# Altium schematic sheet Power.SchDoc
size 420 x 297 mm; SheetNumber: 4; SheetTotal: 10; PageSetup: Record=PageOptions|CenterHorizontal=True|CenterVertical=True|PrintScale=0.96|XCorrection=1.00|YCorrection=1.00|PrintKind=1|BorderSize=5000000|LeftOffset=0|BottomOffset=0|Orientation=2|PaperLength=4318|PaperWidth=2794|Scale=100|PaperSource=7|PrintQuality=600|MediaType=1|DitherType=10|PaperKind=11" x 17"|PrintScaleMode=1
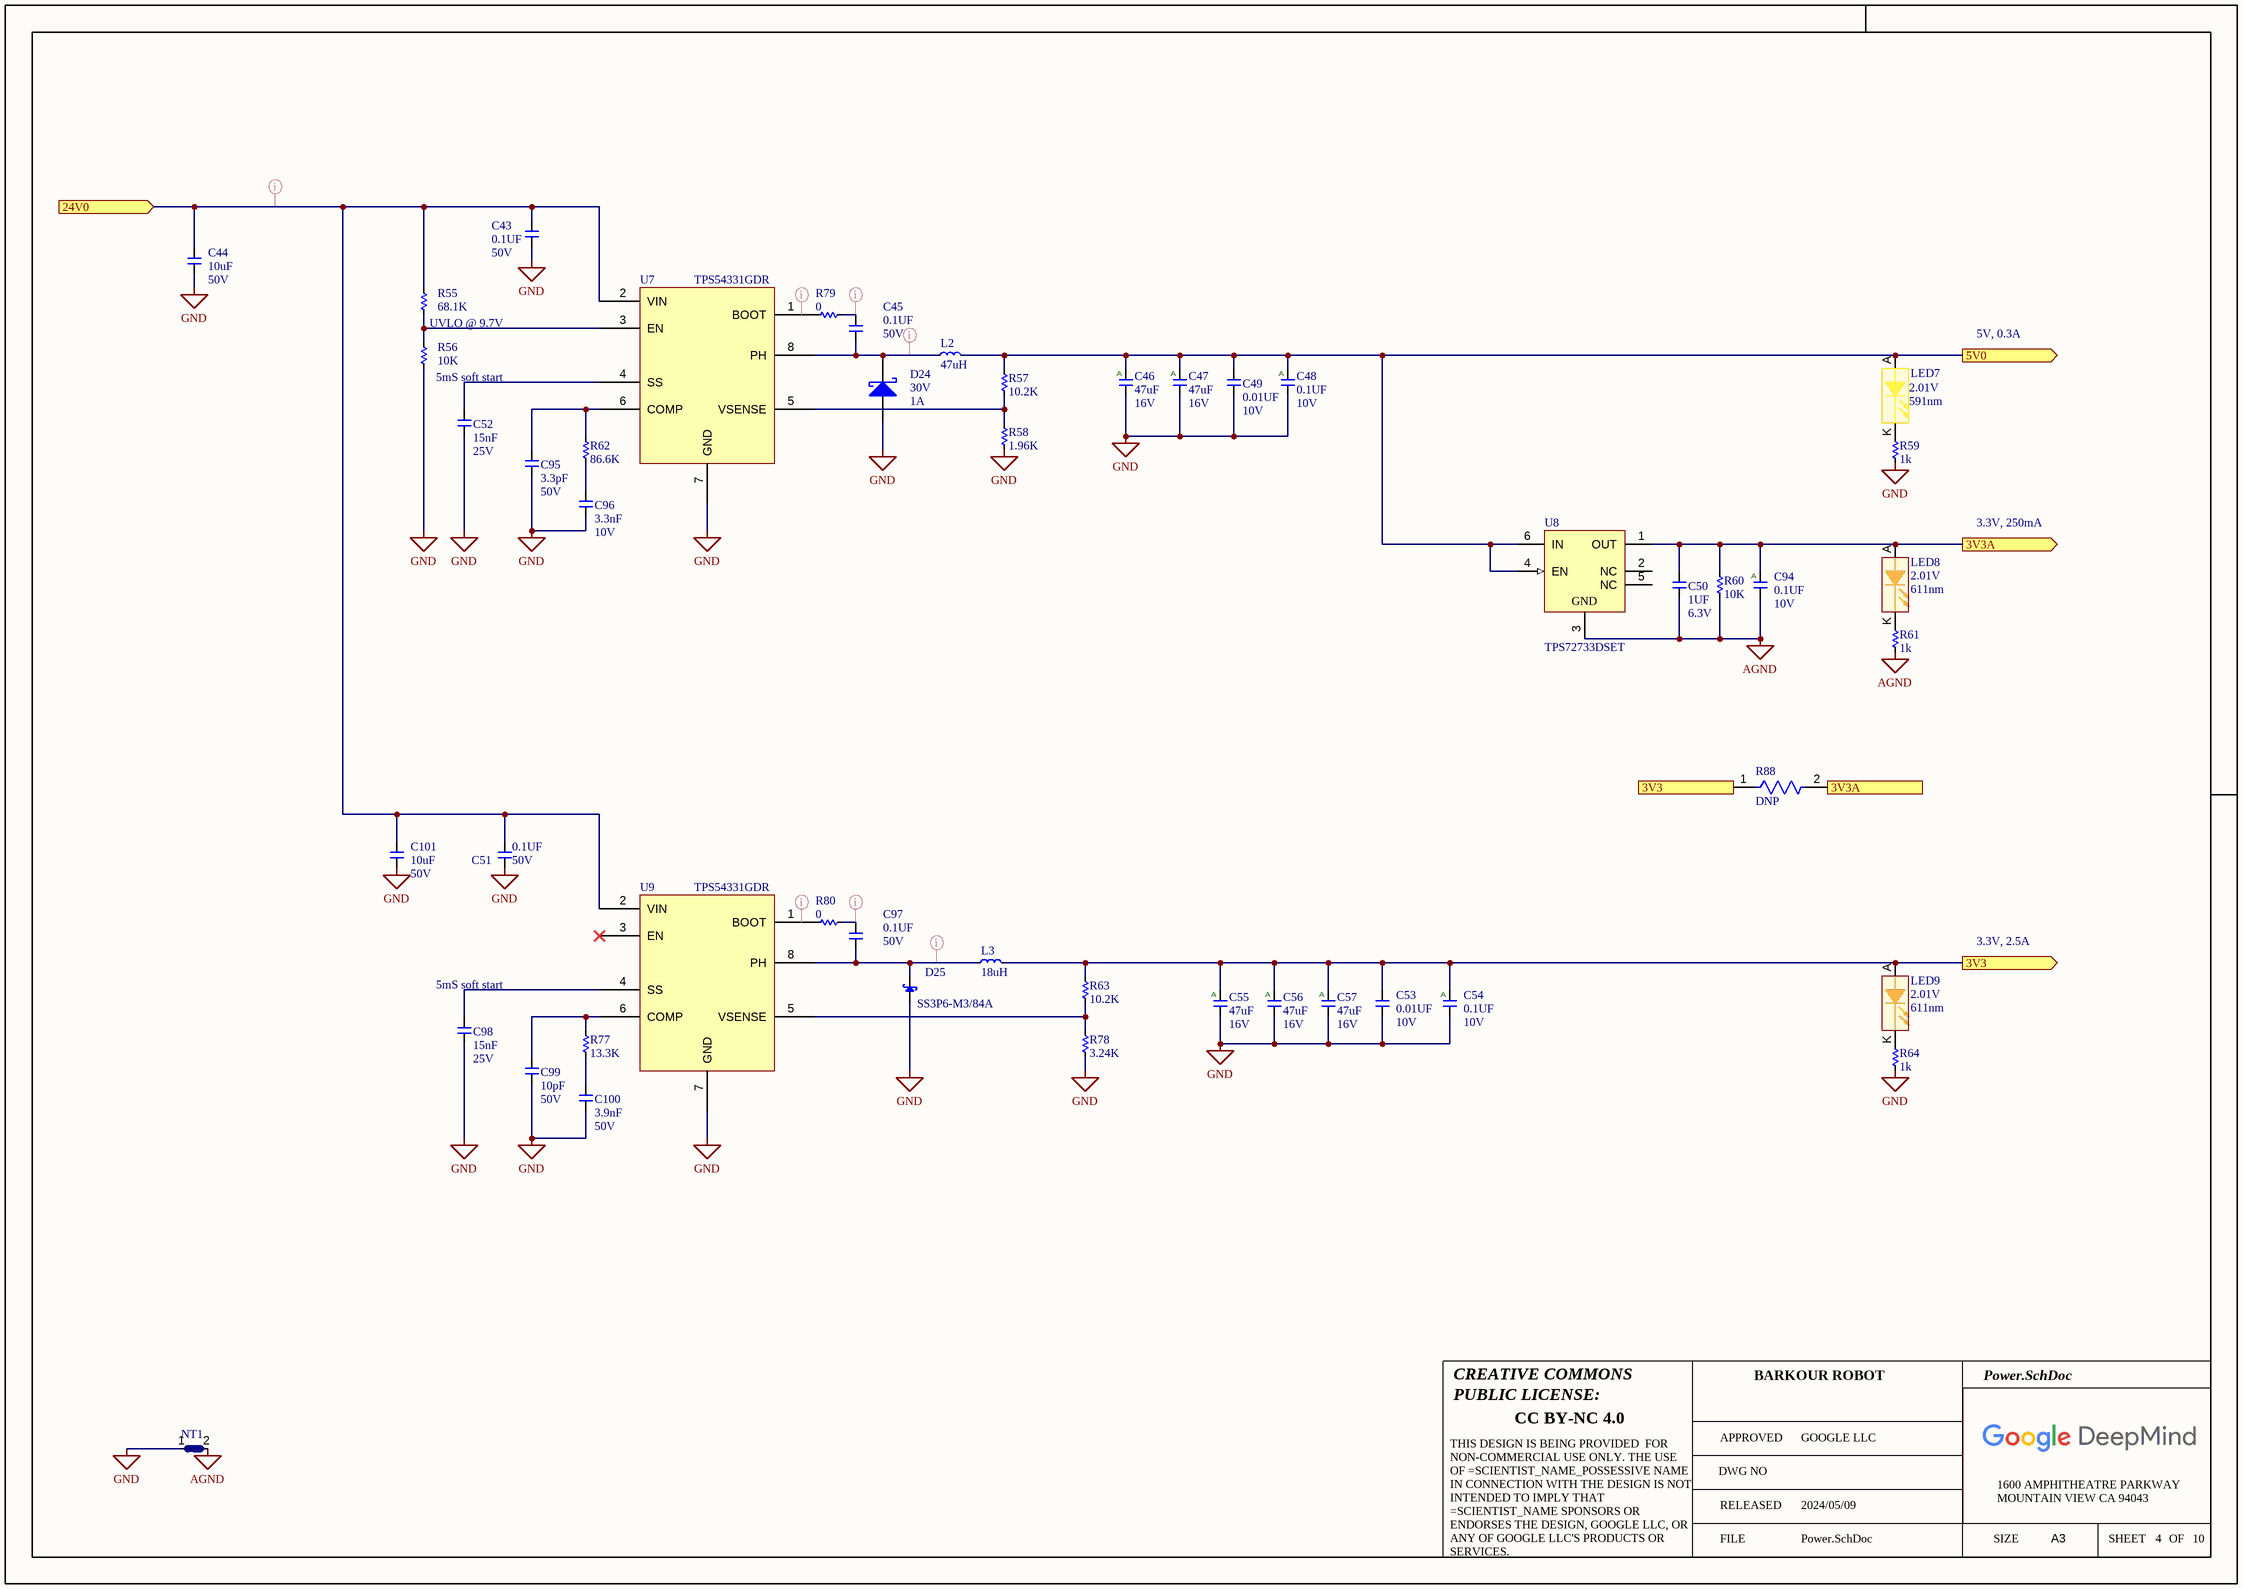
[diagram p0: Power.SchDoc]

## Parts
C43  value 0.1UF  Voltage: 50V  [C0402]  (hidden comment: __Template_Cap)
C44  value 10uF  Voltage: 50V  [C1210_H2.7mm]  (hidden comment: __Template_Cap)
C45  value 0.1UF  Voltage: 50V  [C0402]  (hidden comment: __Template_Cap)
C46  value 47uF  Voltage: 16V  [C2220]  (hidden comment: __Template_Cap_Auto)
C47  value 47uF  Voltage: 16V  [C2220]  (hidden comment: __Template_Cap_Auto)
C48  value 0.1UF  Voltage: 10V  [C0201Y]  (hidden comment: __Template_Cap_Auto)
C49  value 0.01UF  Voltage: 10V  [C0201Y]  (hidden comment: __Template_Cap)
C50  value 1UF  Voltage: 6.3V  [C0201]  (hidden comment: __Template_Cap)
C51  value 0.1UF  Voltage: 50V  [C0402]  (hidden comment: __Template_Cap)
C52  value 15nF  Voltage: 25V  [C0402]  (hidden comment: __Template_Cap)
C53  value 0.01UF  Voltage: 10V  [C0201Y]  (hidden comment: __Template_Cap)
C54  value 0.1UF  Voltage: 10V  [C0201Y]  (hidden comment: __Template_Cap_Auto)
C55  value 47uF  Voltage: 16V  [C2220]  (hidden comment: __Template_Cap_Auto)
C56  value 47uF  Voltage: 16V  [C2220]  (hidden comment: __Template_Cap_Auto)
C57  value 47uF  Voltage: 16V  [C2220]  (hidden comment: __Template_Cap_Auto)
C94  value 0.1UF  Voltage: 10V  [C0201Y]  (hidden comment: __Template_Cap_Auto)
C95  value 3.3pF  Voltage: 50V  [C0201Y]  (hidden comment: __Template_Cap)
C96  value 3.3nF  Voltage: 10V  [C0201]  (hidden comment: __Template_Cap)
C97  value 0.1UF  Voltage: 50V  [C0402]  (hidden comment: __Template_Cap)
C98  value 15nF  Voltage: 25V  [C0402]  (hidden comment: __Template_Cap)
C99  value 10pF  Voltage: 50V  [C0201Y]  (hidden comment: __Template_Cap)
C100  value 3.9nF  Voltage: 50V  [C0402]  (hidden comment: __Template_Cap)
C101  value 10uF  Voltage: 50V  [C1210_H2.7mm]  (hidden comment: __Template_Cap)
D24  Voltage - DC Reverse (VR) (MAX): 30V  Current - Average Rectified (IO): 1A  [SOD-123_H1.35MM]  (hidden comment: __Template_DIODE_SCHOTTKY)
D25  value SS3P6-M3/84A  [DO-220AA_A/K]  (hidden comment: __Template_Diode_Schottky_A/K)
L2  Inductance: 47uH  [IND_LPS3015-152MRB]  (hidden comment: COILCRAFT_LPS3015-473)
L3  Inductance: 18uH  [INDP100100X51N]  (hidden comment: BOURNS_SRR1050A-180Y)
LED7  Voltage – Forward (VF) (MAX) @ IF: 2.01V  Color / Wavelength: 591nm  [LED_APG0603SYC-TT]  (hidden comment: __Template_LED_YELLOW_AK)
LED8  Voltage – Forward (VF) (MAX) @ IF: 2.01V  Color / Wavelength: 611nm  [LED_APG0603SYC-TT]  (hidden comment: __Template_LED_ORANGE_AK)
LED9  Voltage – Forward (VF) (MAX) @ IF: 2.01V  Color / Wavelength: 611nm  [LED_APG0603SYC-TT]  (hidden comment: __Template_LED_ORANGE_AK)
NT1  _Template_NETTIE  [NETTIE_0402]  (value not drawn)  (net tie, no BOM)
R55  value 68.1K  [R0201_H0.26MM]  (hidden comment: __Template_Resistor)
R56  value 10K  [R0201_H0.26MM]  (hidden comment: __Template_Resistor)
R57  value 10.2K  [R0201]
R58  value 1.96K  [R0201]
R59  value 1k  [R0201_H0.26MM]  (hidden comment: __Template_Resistor)
R60  value 10K  [R0201_H0.26MM]  (hidden comment: __Template_Resistor)
R61  value 1k  [R0201_H0.26MM]  (hidden comment: __Template_Resistor)
R62  value 86.6K  [R0201]
R63  value 10.2K  [R0201]
R64  value 1k  [R0201_H0.26MM]  (hidden comment: __Template_Resistor)
R77  value 13.3K  [R0201]
R78  value 3.24K  [R0201]
R79  value 0  [R0402]
R80  value 0  [R0402]
R88  DNP  [FP-CRCW0402-e3-IPC_C]
U7  Manufacturer Part Number: TPS54331GDR  [SOIC127P600X175-8N]  (hidden comment: TI_TPS54331GDR)
U8  TPS72733DSET  [DES0006A_V]
U9  Manufacturer Part Number: TPS54331GDR  [SOIC127P600X175-8N]  (hidden comment: TI_TPS54331GDR)

## Ports
3V3 (out), 3V3A (out), 5V0 (out), 24V0 (in)

## Nets
AGND: C50.2 C94.2 NT1.2 R60.1 R61.2 U8.3(GND)
GND: C43.2 C44.2 C46.2 C47.2 C48.2 C49.2 C51.2 C52.2 C53.2 C54.2 C55.2 C56.2 C57.2 C95.2 C96.2 C98.2 C99.1 C100.2 C101.2 D24.A D25.A NT1.1 R56.1 R58.1 R59.2 R64.2 R78.1 U7.7(GND) U9.7(GND)
3V3: C53.1 C54.1 C55.1 C56.1 C57.1 L3.2 LED9.A R63.2 R88.1 ; port 3V3
3V3A: C50.1 C94.1 LED8.A R60.2 R88.2 U8.1(OUT) ; port 3V3A
5V0: C46.1 C47.1 C48.1 C49.1 L2.2 LED7.A R57.2 U8.4(EN) U8.6(IN) ; port 5V0
24V0: C43.1 C44.1 C51.1 C101.1 R55.2 U7.2(VIN) U9.2(VIN) ; port 24V0
NetC45_1: C45.1 R79.2
NetC45_2: C45.2 D24.K L2.1 U7.8(PH)
NetC52_1: C52.1 U7.4(SS)
NetC95_1: C95.1 R62.2 U7.6(COMP)
NetC96_1: C96.1 R62.1
NetC97_1: C97.1 R80.2
NetC97_2: C97.2 D25.K L3.1 U9.8(PH)
NetC98_1: C98.1 U9.4(SS)
NetC99_2: C99.2 R77.2 U9.6(COMP)
NetC100_1: C100.1 R77.1
NetLED7_K: LED7.K R59.1
NetLED8_K: LED8.K R61.1
NetLED9_K: LED9.K R64.1
NetR55_1: R55.1 R56.2 U7.3(EN)
NetR57_1: R57.1 R58.2 U7.5(VSENSE)
NetR63_1: R63.1 R78.2 U9.5(VSENSE)
NetR79_1: R79.1 U7.1(BOOT)
NetR80_1: R80.1 U9.1(BOOT)

Not connected (* = marked no-connect by the designer): U8 2(NC) 5(NC); U9 3(EN)*

## Layout directives
net class 24V: 24V0, (no net found under the mark), NetC45_1, NetC45_2, NetC97_1, NetC97_2

## Notes on the sheet
- UVLO @ 9.7V
- 5mS soft start
- 5V, 0.3A
- 3.3V, 250mA
- 3.3V, 2.5A
- CREATIVE COMMONS
- PUBLIC LICENSE:
- BARKOUR ROBOT
- CC BY-NC 4.0
- APPROVED
- DWG NO
- GOOGLE LLC
- FILE
- RELEASED
- 2024/05/09
- SIZE
- 1600 AMPHITHEATRE PARKWAY
- MOUNTAIN VIEW CA 94043
- A3
- SHEET
- OF
- THIS DESIGN IS BEING PROVIDED  FOR NON-COMMERCIAL USE ONLY. THE USE OF =SCIENTIST_NAME_POSSESSIVE NAME IN CONNECTION WITH THE DESIGN IS NOT INTENDED TO IMPLY THAT =SCIENTIST_NAME SPONSORS OR ENDORSES THE DESIGN, GOOGLE LLC, OR ANY OF GOOGLE LLC'S PRODUCTS OR SERVICES.
- (in symbol 163) A
- (in symbol 934) A

## Library data of the parts
C43 C45 C51 C97 = 1762: CAP, CER, X5R, 0.1uF, 10%, 50V, 0402, 0.55mm; ID: 1762; MFG: YAGEO; MFG P/N: CC0402KRX5R9BB104; EPIC: G150-02449-00; EES: 150-04581-00; Status: Released; Package: 0402; Dielectric: X5R; Tolerance: 10%; Height: 0.55mm; Supplier 1: Digi-Key; HelpURL: https://www.digikey.com/product-detail/en/yageo/CC0402KRX5R9BB104/311-3342-1-ND/6818312; ComponentLink1Description: Datasheet; ComponentLink1URL: http://www.yageo.com/documents/recent/UPY-GPHC_X5R_4V-to-50V_25.pdf; Supplier Part Number 1: 311-3342-1-ND
C44 C101 = 1813: CAP, CER, X5R, 10uF, 50V, 20%, 1210; ID: 1813; MFG: TAIYO YUDEN; MFG P/N: UMK325BJ106MM-T; Gecko: 150-04488-00; EES: 150-04569-00; Status: Released; Package: 1210; Dielectric: X5R; Tolerance: 20%; Height: 2.7mm; Supplier 1: Digi-Key; HelpURL: https://www.digikey.com/product-detail/en/taiyo-yuden/UMK325BJ106MM-T/587-2225-1-ND/2002923; ComponentLink1Description: Datasheet; ComponentLink1URL: https://media.digikey.com/pdf/Data%20Sheets/Taiyo%20Yuden%20PDFs%20URL%20links/UMK325BJ106MM-T_Spec.pdf; Supplier Part Number 1: 587-2225-1-ND
C46 C47 C55-C57 = 163: CAP, CER, X7R, 47uF, 16V, 20%, AUTO GRADE, 2220, 2.5mm T; ID: 163; MFG: TDK; MFG P/N: CGA9N3X7R1C476M230KB; XPN: 150-00499-00; Status: Released; Package: 2220; Dielectric: X7R; Tolerance: 20%; Height: 2.5mm T; ComponentLink1Description: Datasheet; COMMON: 150-00499-00
C48 C54 C94 = 934: CAP, CER, X6S, 0.1uF, 10V, 10%, 0201, AUTOGRADE; ID: 934; MFG: MURATA; MFG P/N: GRT033C81A104KE01D; XPN: 150-01178-00; Gecko: 150-04546-00; EES: 150-04563-00; Status: Released; Package: 0201; Dielectric: X6S; Tolerance: 10%; Height: 0.33mm T; Supplier 1: Digi-key; HelpURL: https://www.digikey.com/product-detail/en/murata-electronics/GRT033C81A104KE01D/490-12232-1-ND/5416933; ComponentLink1Description: Datasheet; ComponentLink1URL: https://search.murata.co.jp/Ceramy/image/img/A01X/G101/ENG/GRT033C81A104KE01-01.pdf; COMMON: 150-01178-00; LOON: 150-01178-00; Supplier Part Number 1: 490-12232-1-ND
C49 C53 = 361: CAP, CER, X7R, 0.01uF, 10V, 10%, AUTO GRADE, 0201, 0.33mm T; ID: 361; MFG: MURATA; MFG P/N: GCM033R71A103KA03D; XPN: 150-01021-00; EES: 150-04564-00; Status: Released; Package: 0201; Dielectric: X7R; Tolerance: 10%; Height: 0.33mm T; ComponentLink1Description: Datasheet; COMMON: 150-01021-00; LOON: 150-01021-00; Gecko: 150-01021-00
C50 = 240: CAP, CER, X5R, 1uF, 6.3V, 20%, 0201, 0.33mm T; ID: 240; MFG: SAMSUNG; MFG P/N: CL03A105MQ3CSNC; XPN: 150-00980-00; EPIC: G150-00980-00; EES: 150-04572-00; Status: Released; Package: 0201; Dielectric: X5R; Tolerance: 20%; Height: 0.35mm; ComponentLink1Description: Datasheet; COMMON: 150-00980-00; LOON: 150-00980-00; Gecko: 150-00980-00
C52 C98 = 838: CAP, CER, X7R, 0.015uF, 25V, 10%, 0402, 0.56mm T; ID: 838; MFG: MURATA; MFG P/N: GRM155R71E153KA61D; XPN: 150-00741-00; Status: NRND; Package: 0402; Dielectric: X7R; Tolerance: 10%; Height: 0.56mm T; ComponentLink1Description: Datasheet; COMMON: 150-00741-00
C95 = 589: CAP, CER, NP0, 3.3pF, 50V, +/-0.25pF, 0201, 0.33mm T; ID: 589; MFG: MURATA; MFG P/N: GRM0335C1H3R3CA01D; Tolerance: 0.25pF; XPN: 150-00958-00; Status: Released; Package: 0201; Dielectric: NP0; Height: 0.33mm T; ComponentLink1Description: Datasheet; COMMON: 150-00958-00
C96 = 343: CAP, CER, X5R, 3300pF, 10V, 10%, 0201, 0.33mm T; ID: 343; MFG: AVX; MFG P/N: 0201ZD332KAT2A; XPN: 150-00555-00; Status: Released; Package: 0201; Dielectric: X5R; Tolerance: 10%; Height: 0.33mm T; ComponentLink1Description: Datasheet; COMMON: 150-00555-00
C99 = 49: CAP, CER, NP0, 10pf, 50V, 5%, 0201, 0.33mm T; ID: 49; MFG: MURATA; MFG P/N: GRM0335C1H100JA01J; XPN: 150-00985-00; Status: Released; Package: 0201; Dielectric: NP0; Tolerance: 5%; Height: 0.33mm T; ComponentLink1Description: Datasheet; COMMON: 150-00985-00
C100 = 377: CAP, CER, X7R, 3900pF, 50V, 10%, 0402, 0.56mm T; ID: 377; MFG: MURATA; MFG P/N: GRM155R71H392KA01D; XPN: 150-00747-00; Status: NRND; Package: 0402; Dielectric: X7R; Tolerance: 10%; Height: 0.56mm T; ComponentLink1Description: Datasheet; COMMON: 150-00747-00
D24 = 290: DIODE, SCHOTTKY, 30V VRRM, 1A IO, 12A SURGE, SOD-123; ID: 290; MFG: Diodes Incorporated; MFG P/N: B130LAW-7-F; Value: B130LAW-7-F; Voltage – Forward (VF) (MAX) @ IF: 420mV @ 1A; Current - Reverse Leakage @ VR: 1mA @ 30V; Gecko: 480-01710-00; Status: Released; Package: SOD-123; Category: Diode; RoHS Compliant: Yes; Diode Type: Schottky; Mounting Type: SMD; Operating Temperature – Junction: -55°C ~ 125°C; Supplier 1: Digi-Key; HelpURL: https://www.digikey.com/product-detail/en/diodes-incorporated/B130LAW-7-F/B130LAW-FDICT-ND/725052; ComponentLink1Description: Datasheet; ComponentLink1URL: https://www.diodes.com/assets/Datasheets/ds30308.pdf; Height: 1.35mm; Supplier Part Number 1: B130LAW-FDICT-ND
D25 = 35: DIODE, SCHOTTKY, 60V, 3A, DO220AA; ID: 35; MFG: VISHAY; Voltage – Forward (VF) (MAX) @ IF: 780mV @ 3A; Current - Reverse Leakage @ VR: 100µA @ 60V; COMMON: 480-00844-00; XPN: XS-10020789; Status: Released; MFG P/N: SS3P6-M3/84A; Package: DO220AA; Category: Diode; Diode Type: SCHOTTKY; Mounting Type: SM; Voltage - DC Reverse (VR) (MAX): 60V; Current - Average Rectified (IO): 3A; Operating Temperature – Junction: -55°C ~ 150°C; Supplier 1: Digi-Key; HelpURL: http://www.vishay.com/docs/88997/ss3p5.pdf; ComponentLink1Description: Datasheet; ComponentLink1URL: http://www.vishay.com/docs/88997/ss3p5.pdf; Supplier Part Number 1: SS3P6-M3/84AGICT-ND
L2 = COILCRAFT_LPS3015-473: COILCRAFT   LPS3015-473MRB   INDUCTOR, SHLD, 47UH, 20%, 0.3A, SMD; RMS Current (Irms): 300mA; Saturation Current: 380mA; DC Resistance (DCR): 1.55R; Supplier 1: Mouser; Supplier Part Number 1: 994-LPS3015-473MRB; Manufacturer: Coilcraft; Manufacturer Part Number: LPS3015-473MRB; RoHS: Yes; Category: Inductors; Mount: Surface Mount; Inductance Tolerance: 20%; Packaging: Cut Tape; REACH SVHC: No SVHC; RoHS Compliant: Yes; ComponentLink1URL: http://www.farnell.com/datasheets/1805321.pdf?src-supplier=Farnell; ComponentLink1Description: http://www.farnell.com/datasheets/1805321.pdf?src-supplier=Farnell; ComponentLink2URL: http://www.farnell.com/datasheets/1805321.pdf?src-supplier=Element14; ComponentLink2Description: http://www.farnell.com/datasheets/1805321.pdf?src-supplier=Element14
L3 = BOURNS_SRR1050A-180Y: FIXED IND 18UH 3.1A 51 MOHM SMD; Manufacturer: Bourns; Saturation Current: 3.2A; DC Resistance (DCR): 51mR; Inductance Tolerance: 30%; Supplier 1: Digi-Key; Supplier Part Number 1: SRR1050A-180YCT-ND; Manufacturer Part Number: SRR1050A-180Y; RoHS: Yes; Category: Fixed Inductors; Stock 1: 545; Pricing 1: 1=1.31000, 10=1.21900, 25=1.12520, 50=0.93780, 100=0.88150, 250=0.78772 (USD); Mount: Surface Mount; RMS Current (Irms): 3.1A; Packaging: Cut Tape; REACH SVHC: No SVHC; RoHS Compliant: Yes; ComponentLink1URL: https://www.bourns.com/docs/Product-Datasheets/SRR1050A.pdf?src-supplier=Digi-Key; ComponentLink1Description: https://www.bourns.com/docs/Product-Datasheets/SRR1050A.pdf?src-supplier=Digi-Key; ComponentLink2URL: http://www.farnell.com/datasheets/2113225.pdf?src-supplier=Element14; ComponentLink2Description: http://www.farnell.com/datasheets/2113225.pdf?src-supplier=Element14
LED7 = 307: LED, YELLOW, 591NM, 10mA, CLEAR, 0201; ID: 307; MFG: Kingbright; MFG P/N: APG0603SYC-TT; Value: APG0603SYC-TT; EES: 370-00612-00; Status: Released; Package: 0201; Category: LED; RoHS Compliant: Yes; Diode Type: LED; Mounting Type: SMD; Supplier 1: Digi-Key; HelpURL: https://www.digikey.com/product-detail/en/kingbright/APG0603SYC-TT/754-2025-1-ND/6072772; ComponentLink1Description: Datasheet; ComponentLink1URL: http://www.kingbrightusa.com/images/catalog/SPEC/APG0603SYC-TT.pdf; Height: 0.25mm; Supplier Part Number 1: 754-2025-1-ND
LED8 LED9 = 308: LED, ORANGE, 611NM, 10mA, CLEAR, 0201; ID: 308; MFG: Kingbright; MFG P/N: APG0603SEC-TT; Value: APG0603SEC-TT; EES: 370-00613-00; Status: Released; Package: 0201; Category: LED; RoHS Compliant: Yes; Diode Type: LED; Mounting Type: SMD; Supplier 1: Digi-Key; HelpURL: https://www.digikey.com/product-detail/en/kingbright/APG0603SEC-TT/754-2027-1-ND/6072774; ComponentLink1Description: Datasheet; ComponentLink1URL: http://www.kingbrightusa.com/images/catalog/SPEC/APG0603SEC-TT.pdf; Height: 0.25mm; Supplier Part Number 1: 754-2027-1-ND
NT1 = 158: Net Ties, 0402; ID: 158; MFG: _PCB Feature; Status: Released; Category: Net Tie
R55 = 10007: RES, 68.1K, 1%, 1/20W, 0201, AUTOGRADE; ID: 10007; MFG: Panasonic Electronic Components; MFG P/N: ERJ-1GNF6812C; Catagory: Chip Resistor - Surface Mount; Power: 0.05W, 1/20W; EES: 470-18017-00; Status: Released; Package: 0201; Tolerance: 1%; Height: 0.26mm; Supplier 1: Digi-Key; HelpURL: https://www.digikey.in/product-detail/en/panasonic-electronic-components/ERJ-1GNF6812C/P123130CT-ND/8343199; ComponentLink1Description: Datasheet; ComponentLink1URL: https://industrial.panasonic.com/cdbs/www-data/pdf/RDA0000/AOA0000C304.pdf; Supplier Part Number 1: P123130CT-ND
R56 R60 = 6783: RES, 10K, 1%, 1/20W, 0201, AUTOGRADE; ID: 6783; MFG: PANASONIC; MFG P/N: ERJ1GNF1002C; COMMON: 470-00033-00; PROXY: Use ID #4151; EES: 470-18014-00; Status: Released; Package: 0201; Power: 1/20W; Tolerance: 1%; Height: 0.26mm; Supplier 1: Digi-Key; HelpURL: https://www.digikey.in/product-detail/en/panasonic-electronic-components/ERJ-1GNF1002C/P122414CT-ND/7389440; ComponentLink1Description: Datasheet; ComponentLink1URL: https://industrial.panasonic.com/cdbs/www-data/pdf/RDA0000/AOA0000C304.pdf; LOON: 470-00033-00; Gecko: 470-00033-00; XPN: 470-00033-00; Supplier Part Number 1: P122414CT-ND
R57 R63 = 4161: Resistor, 10.2K Ohms, 0201, 0.05W, ±1%; ID: 4161; MFG: YAGEO; MFG P/N: RC0201FR-0710K2L; Power: 1/20W; COMMON: 470-07513-00; XPN: XS-10018168; Status: Released; Package: 0201; Tolerance: 1%; Height: 0.26mm; Supplier 1: Digi-Key; Supplier Part Number 1: 311-10.2KMCT-ND
R58 = 6790: RES, 1.96K, 1%, 1/20W, 0201; ID: 6790; MFG: PANASONIC; MFG P/N: ERJ1GEF1961C; COMMON: 470-00892-00; PROXY: Alt ID #9405; XPN: XS-10012653; Status: NRND; Package: 0201; Power: 1/20W; Tolerance: 1%
R59 R61 R64 = 10010: RES, 1K, 1%, 1/20W, 0201, AUTOGRADE; ID: 10010; MFG: Bourns Inc.; MFG P/N: CR0201AFW-1001GLF; Power: 0.05W, 1/20W; Catagory: Chip Resistor - Surface Mount; EES: 470-18022-00; Status: Released; Package: 0201; Tolerance: 1%; Height: 0.26mm; Supplier 1: Digi-Key; HelpURL: https://www.digikey.in/product-detail/en/bourns-inc/CR0201AFW-1001GLF/118-CR0201AFW-1001GLFCT-ND/12091423; ComponentLink1Description: Datasheet; ComponentLink1URL: https://www.bourns.com/docs/product-datasheets/crxxxxa.pdf; Supplier Part Number 1: 118-CR0201AFW-1001GLFCT-ND
R62 = 4926: Resistor, 86.6K Ohms, 0201, 0.05W, ±1%; ID: 4926; MFG: PANASONIC; MFG P/N: ERJ-1GEF8662C; Power: 1/20W; COMMON: 470-01358-00; Status: NRND; Package: 0201; Tolerance: 1%; Height: 0.26mm; Supplier 1: Digi-Key; XPN: 470-01358-00; Supplier Part Number 1: P86.6KABCT-ND
R77 = 4248: Resistor, 13.3K Ohms, 0201, 0.05W, ±1%; ID: 4248; MFG: PANASONIC; MFG P/N: ERJ-1GEF1332C; Power: 1/20W; COMMON: 470-07589-00; XPN: XS-10018236; Status: NRND; Package: 0201; Tolerance: 1%; Height: 0.26mm; Supplier 1: Digi-Key; Supplier Part Number 1: P13.3KABCT-ND
R78 = 7433: RES, 3.24K, 1%, 1/20W, 0201; ID: 7433; MFG: PANASONIC; MFG P/N: ERJ1GEF3241C; COMMON: 470-01101-00; XPN: XS-10012809; Status: NRND; Package: 0201; Power: 1/20W; Tolerance: 1%
R79 R80 = 8004: RES, 0, JUMPER, 1/16W, 0402; ID: 8004; MFG: YAGEO; MFG P/N: RC0402FR-070RL; COMMON: 470-02332-00; PROXY: Use ID #2; Gecko: 470-17892-00; Status: Released; Package: 0402; Power: 1/16W; Tolerance: JUMPER; XPN: 470-02332-00
R88 = CMP-2002-08122-2: RES Thick Film, 0Ω, 0.063W, 0402; Tolerance: 5%; Max Power Dissipation: 63mW; Voltage Rating: 50V; Temperature Coefficient: 100ppm/°C; Resistance: 0mR; Contact Plating: Tin; Height: 0.35mm; Radiation Hardening: No; Features: Automotive AEC-Q200; Composition: Thick Film; Width: 0.5mm; Weight: 2.3E-05oz; Termination: SMD/SMT; Packaging: Tape and Reel; Mount: Surface Mount; Case Code (Metric): 1005; Military Standard: Not; Min Operating Temperature: -55°C; Number of Terminations: 2; Package Quantity: 1; Case Code (Imperial): 0402; Depth: 0.5mm; Max Operating Temperature: 155°C; Case/Package: 0402; Power Rating: 63mW; Lead Free: Lead Free; Voltage Rating (DC): 50V; Length: 1mm
U7 U9 = TI_TPS54331GDR: Conv DC-DC Single Step Down 3.5V to 28V 8-Pin SOIC T/R; Manufacturer: Texas Instruments; Output Current: 3A; Output Voltage: 25V; Switching Frequency: 570kHz; Number of Outputs: 1; Synchronous Rectifier: No; Quiescent Current: 110uA; Min Output Voltage: 800mV; Output Type: Adjustable; Supplier 1: Digi-Key; Supplier Part Number 1: 296-50099-1-ND; RoHS: Yes; Category: Voltage Regulators - Switching; Stock 1: 2585; Pricing 1: 1=1.85000, 10=1.66300, 25=1.56880, 100=1.33660, 250=1.25504, 500=1.09816, 1000=1.03600 (USD); Case/Package: D; Number of Pins: 8; Min Operating Temperature: -40°C; Max Operating Temperature: 150°C; Package Quantity: 2500; Series: SWIFT™, Eco-Mode™; Packaging: Tape and Reel; Max Output Current: 3A; Max Input Voltage: 28V; Min Input Voltage: 3.5V; Max Output Voltage: 25V; Operating Supply Voltage: 28V; Lead Free: Lead Free; RoHS Compliant: Yes; ComponentLink1URL: https://datasheet.ciiva.com/2034/tps54331-2034843.pdf?src-supplier=Digi-Key; ComponentLink1Description: https://datasheet.ciiva.com/2034/tps54331-2034843.pdf?src-supplier=Digi-Key; ComponentLink2URL: https://datasheet.ciiva.com/14378/tps54331-14378086.pdf?src-supplier=Avnet; ComponentLink2Description: https://datasheet.ciiva.com/14378/tps54331-14378086.pdf?src-supplier=Avnet
U8 = CMP-0394-01493-2: Single Output Fast Transient Response LDO, 250 mA, Fixed 3.3 V Output, 2 to 5.5 V Input, with Ultra-Low IQ, 6-pin WSON (DSE), -40 to 125 degC, Green (RoHS & no Sb/Br); Manufacturer: Texas Instruments; Vin(Min)(V): 2; Rating: Catalog; Vdo(Typ)(mV): 130; Fixed Output Options(V): 3.3; Iq(Typ)(mA): 0.008; SubFamily: Single Channel LDO; Iout(Max)(A): 0.25; Vin(Max)(V): 5.5; ComponentLink1Description: Manufacturer URL; ComponentLink1URL: http://www.ti.com/; PackageVersion: 4207810/A; DatasheetVersion: SBVS128C; Mounting Technology: Surface Mount; Eco-Plan: Green (RoHS & no Sb/Br); Vout Adj(Min)(V): 3.3; ComponentLink3Description: Package Specification; ComponentLink3URL: http://www.ti.com/litv/pdf/mpds287; ComponentLink2Description: Datasheet; PackageReference: DES0006A; ComponentLink2URL: http://www.ti.com/general/docs/lit/getliterature.tsp?genericPartNumber=TPS72733&fileType=pdf; PackageDescription: 6-Pin Plastic Small Outline, Body 1.5 x 1.5 mm, Pitch 0.5 mm; PartNumber: TPS72733DSET; Accuracy(%): 2; Vout Adj(Max)(V): 3.3; Manufacturer Part Number: TPS72733DSET